# Altium schematic sheet fpga_headers.SchDoc
size A4
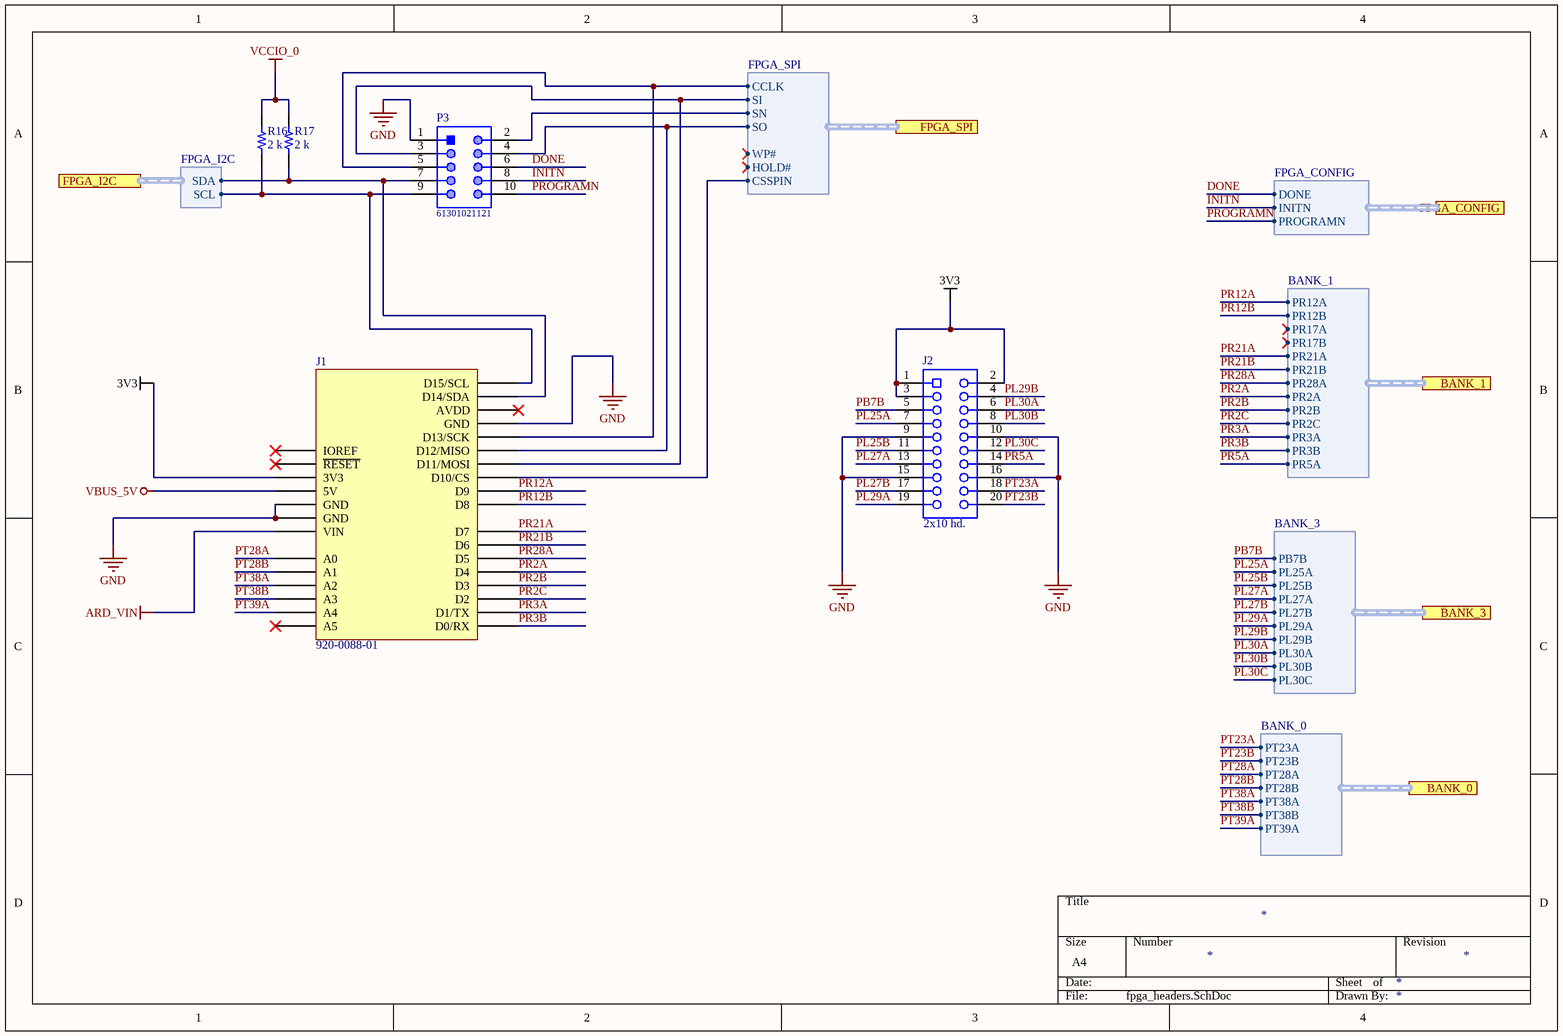
[diagram p0: fpga_headers.SchDoc]

## Parts
J1  920-0088-01  [SCHMARTBOARD - 920-0088-01]
J2  2x10 hd.  [SLIN-PPPC102LFBN-RC_V]
P3  61301021121  [61301021121]
R16  2 k  [RES 0603_1608]
R17  2 k  [RES 0603_1608]

## Ports
BANK_0 (harness BANK_0), BANK_1 (harness BANK_1), BANK_3 (harness BANK_3), FPGA_CONFIG (harness FPGA_CONFIG), FPGA_I2C (harness FPGA_I2C), FPGA_SPI (harness FPGA_SPI)

## Harnesses
FPGA_I2C: SCL, SDA
BANK_1: PR12A, PR12B, PR17A, PR17B, PR21A, PR21B, PR28A, PR2A, PR2B, PR2C, PR3A, PR3B, PR5A
BANK_3: PB7B, PL25A, PL25B, PL27A, PL27B, PL29A, PL29B, PL30A, PL30B, PL30C
FPGA_CONFIG: DONE, INITN, PROGRAMN
FPGA_SPI: CCLK, CSSPIN, HOLD#, SI, SN, SO, WP#
BANK_0: PT23A, PT23B, PT28A, PT28B, PT38A, PT38B, PT39A

## Nets
3V3: J1.4(3V3) J2.1 J2.2 J2.3
ARD_VIN: J1.8(VIN)
GND: J1.6(GND) J1.7(GND) J1.29(GND) J2.9 J2.10 J2.15 J2.16 P3.1
VBUS_5V: J1.5(5V)
VCCIO_0: R16.2 R17.2
DONE: P3.6 ; port FPGA_CONFIG.DONE
INITN: P3.8 ; port FPGA_CONFIG.INITN
PB7B: J2.5 ; port BANK_3.PB7B
PL25A: J2.7 ; port BANK_3.PL25A
PL25B: J2.11 ; port BANK_3.PL25B
PL27A: J2.13 ; port BANK_3.PL27A
PL27B: J2.17 ; port BANK_3.PL27B
PL29A: J2.19 ; port BANK_3.PL29A
PL29B: J2.4 ; port BANK_3.PL29B
PL30A: J2.6 ; port BANK_3.PL30A
PL30B: J2.8 ; port BANK_3.PL30B
PL30C: J2.12 ; port BANK_3.PL30C
PR2A: J1.19(D4) ; port BANK_1.PR2A
PR2B: J1.18(D3) ; port BANK_1.PR2B
PR2C: J1.17(D2) ; port BANK_1.PR2C
PR3A: J1.16(D1/TX) ; port BANK_1.PR3A
PR3B: J1.15(D0/RX) ; port BANK_1.PR3B
PR5A: J2.14 ; port BANK_1.PR5A
PR12A: J1.24(D9) ; port BANK_1.PR12A
PR12B: J1.23(D8) ; port BANK_1.PR12B
PR21A: J1.22(D7) ; port BANK_1.PR21A
PR21B: J1.21(D6) ; port BANK_1.PR21B
PR28A: J1.20(D5) ; port BANK_1.PR28A
PROGRAMN: P3.10 ; port FPGA_CONFIG.PROGRAMN
PT23A: J2.18 ; port BANK_0.PT23A
PT23B: J2.20 ; port BANK_0.PT23B
PT28A: J1.9(A0) ; port BANK_0.PT28A
PT28B: J1.10(A1) ; port BANK_0.PT28B
PT38A: J1.11(A2) ; port BANK_0.PT38A
PT38B: J1.12(A3) ; port BANK_0.PT38B
PT39A: J1.13(A4) ; port BANK_0.PT39A
NetJ1_25: J1.25(D10/CS) ; port FPGA_SPI.CSSPIN
NetJ1_26: J1.26(D11/MOSI) P3.3 ; port FPGA_SPI.SI
NetJ1_27: J1.27(D12/MISO) P3.4 ; port FPGA_SPI.SO
NetJ1_28: J1.28(D13/SCK) P3.5 ; port FPGA_SPI.CCLK
NetJ1_31: J1.31(D14/SDA) P3.7 R17.1 ; port FPGA_I2C.SDA
NetJ1_32: J1.32(D15/SCL) P3.9 R16.1 ; port FPGA_I2C.SCL
NetP3_2: P3.2 ; port FPGA_SPI.SN

Not connected (* = marked no-connect by the designer): J1 2(IOREF)* 3(~{RESET})* 14(A5)* 30(AVDD)*

## Library data of the parts
J1 = 920-0088-01: CONN HDR 8/10P 0.1 GOLD PCB 6PC; Manufacturer: Schmartboard, Inc.; Connector Type: Header; Contact Length - Post: 0.413" (10.50mm); Number of Positions: 6, 8, 10; Number of Positions Loaded: All; Pitch - Mating: 0.100" (2.54mm); Style: Board to Board; Part Number: 920-0088-01; ComponentLink1Description: Datasheet; ComponentLink1URL: http://schmartboard.com/content/Brochures/920-0088-01.pdf; ComponentLink2Description: DigiKey Link; ComponentLink2URL: http://digikey.com/product-detail/en/schmartboard-inc/920-0088-01/1988-1036-ND/9559319; Contact Finish - Mating: Gold; Contact Finish - Post: Gold; Contact Type: Female Socket; Fastening Type: Push-Pull; Insulation Color: Black; Insulation Height: 0.335" (8.51mm); LastUpdated: 31.01.2020 20:49:58; Lifecycle Status: Active; Minimum Order: 1; Mounting Type: Through Hole; Number of Rows: 1; Packaging: Bulk; Part Status: Active; Price: 5.00; Series: -; Supplier 1: DigiKey; Supplier Part Number 1: 1988-1036-ND; Termination: Solder
J2 = CMP-1770-00003-1: Female Header, Pitch 2.54 mm, 2 x 10 Position, Height 8.75 mm, Tail Length 3.2 mm, -40 to 105 degC, RoHS, Bulk; Max Supply Voltage: 16 V; Frequency: 100 KHz; Case\Package: SOIC; Min Supply Voltage: 4.5 V; Max Ouput Current: -200 mA; Package Quantity: 2500; ComponentLink1Description: Datasheet; Min Operating Temperature: 0 degC; Pins: 8; Weight: 0.002561 oz; Radiation Hardening: No; Mount: Surface Mount; Width: 3.91 mm; RoHSCompliant: true; ComponentLink1URL: http://datasheet.octopart.com/PPPC102LFBN-RC-Sullins-datasheet-8327184.pdf; DatasheetVersion: Rev. D, 10/2007; Max Operating Temperature: 70 degC; Height: 1.58 mm; Length: 4.9 mm; PackageReference: PPPC102LFBN-RC; Packaging: Tape and Reel; REACH SVHC: No SVHC; PackageDescription: Female Header, Pitch 2.54 mm, 2 x 10 Position, Height 8.75 mm, Tail Length 3.2 mm
P3 = CMP-1502-01084-1: THT Vertical Pin Header WR-PHD, Pitch 2.54 mm, Dual Row, 10 pins; Manufacturer: Wurth Elektronik; Working Voltage: 250VAC; Pitch: 2.54mm; Contact Resistance: 20mOhm; Gender: Male; Rated Current: 3A; Withstanding Voltage: 500VAC; Pin Number: 10; Operating Temperature: -40to105degC; Mounting Technology: THT; Publisher: WurthElektronik; Manufacturer URL: http://www.we-online.de; Part Number: 61301021121; Row Number: Dual; Packaging: Bag; Orientation: Vertical; Package Reference: 61301021121; Datasheet URL: https://katalog.we-online.de/em/datasheet/6130xx21121.pdf
R16 R17 = RMCF0603JT2K00: RES 2K OHM 5% 1/10W 0603; Manufacturer: Stackpole Electronics Inc; Power (Watts): 0.1W, 1/10W; Resistance: 2 kOhms; Temperature Coefficient: ±200ppm/°C; Part Number: RMCF0603JT2K00; Value: 2 k; ComponentLink1Description: Datasheet; ComponentLink1URL: https://www.seielect.com/catalog/sei-rmcf_rmcp.pdf; ComponentLink2Description: DigiKey Link; ComponentLink2URL: http://digikey.com/product-detail/en/stackpole-electronics-inc/RMCF0603JT2K00/RMCF0603JT2K00CT-ND/1943177; Composition: Thick Film; Device Package: 0603 (1608 Metric); Features: Automotive AEC-Q200; Height - Seated (Max): 0.022" (0.55mm); LastUpdated: 02.09.2020 1:10:22; Lifecycle Status: Active; Minimum Order: 1; Number of Terminations: 2; Operating Temperature: -55°C ~ 155°C; Package / Case: 0603 (1608 Metric); Packaging: CutTape; PartId: 5994; Part Status: Active; Price: 0.10; Ratings: AEC-Q200; Series: RMCF; Size / Dimension: 0.061" L x 0.031" W (1.55mm x 0.80mm); Supplier 1: DigiKey; Supplier Part Number 1: RMCF0603JT2K00CT-ND; Supplier Device Package: 0603; Tolerance: ±5%